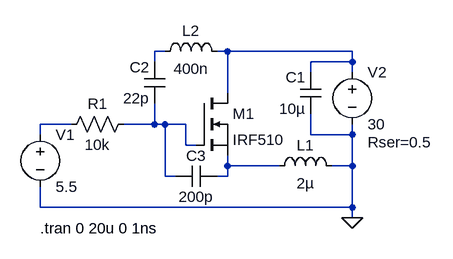
[diagram p0: schematic 3p-oscillator.asc]
3p-oscillator.asc, the LTspice schematic file:
Version 4
SHEET 1 1340 680
WIRE 192 32 176 32
WIRE 288 32 272 32
WIRE 480 32 288 32
WIRE 176 48 176 32
WIRE 480 48 480 32
WIRE 480 48 416 48
WIRE 416 64 416 48
WIRE 480 64 480 48
WIRE 288 96 288 32
WIRE 48 144 0 144
WIRE 176 144 176 112
WIRE 176 144 128 144
WIRE 192 144 176 144
WIRE 224 144 192 144
WIRE 0 160 0 144
WIRE 416 160 416 128
WIRE 480 160 480 144
WIRE 480 160 416 160
WIRE 224 176 224 144
WIRE 240 176 224 176
WIRE 288 208 288 192
WIRE 368 208 288 208
WIRE 480 208 480 160
WIRE 480 208 448 208
WIRE 192 224 192 144
WIRE 208 224 192 224
WIRE 288 224 288 208
WIRE 288 224 272 224
WIRE 0 272 0 240
WIRE 480 272 480 208
WIRE 480 272 0 272
WIRE 480 288 480 272
FLAG 480 288 0
SYMBOL nmos 240 96 R0
SYMATTR InstName M1
SYMATTR Value IRF510
SYMBOL voltage 0 144 R0
WINDOW 123 0 0 Left 2
WINDOW 39 0 0 Left 2
SYMATTR InstName V1
SYMATTR Value 5.5
SYMBOL voltage 480 48 R0
WINDOW 123 0 0 Left 2
WINDOW 39 24 124 Left 2
SYMATTR SpiceLine Rser=0.5
SYMATTR InstName V2
SYMATTR Value 30
SYMBOL cap 432 128 R180
WINDOW 0 24 56 Left 2
WINDOW 3 24 8 Left 2
SYMATTR InstName C1
SYMATTR Value 10µ
SYMATTR SpiceLine Rser=0.01
SYMBOL ind 352 224 R270
WINDOW 0 32 56 VTop 2
WINDOW 3 5 56 VBottom 2
SYMATTR InstName L1
SYMATTR Value 2µ
SYMBOL res 144 128 R90
WINDOW 0 0 56 VBottom 2
WINDOW 3 32 56 VTop 2
SYMATTR InstName R1
SYMATTR Value 10k
SYMBOL ind 176 48 R270
WINDOW 0 32 56 VTop 2
WINDOW 3 5 56 VBottom 2
SYMATTR InstName L2
SYMATTR Value 400n
SYMBOL cap 192 112 R180
WINDOW 0 24 56 Left 2
WINDOW 3 24 8 Left 2
SYMATTR InstName C2
SYMATTR Value 22p
SYMBOL cap 272 208 R90
WINDOW 0 0 32 VBottom 2
WINDOW 3 32 32 VTop 2
SYMATTR InstName C3
SYMATTR Value 200p
TEXT 0 304 Left 2 !.tran 0 20u 0 1ns

The netlist it stands for:
* 3p-oscillator.asc
M1 N002 N004 N005 N005 IRF510
V1 N003 0 5.5
V2 N002 0 30 Rser=0.5
C1 0 N002 10µ Rser=0.01
L1 N005 0 2µ
R1 N004 N003 10k
L2 N001 N002 400n
C2 N004 N001 22p
C3 N005 N004 200p
.model NMOS NMOS
.model PMOS PMOS
.lib standard.mos
.tran 0 20u 0 1ns
.backanno
.end